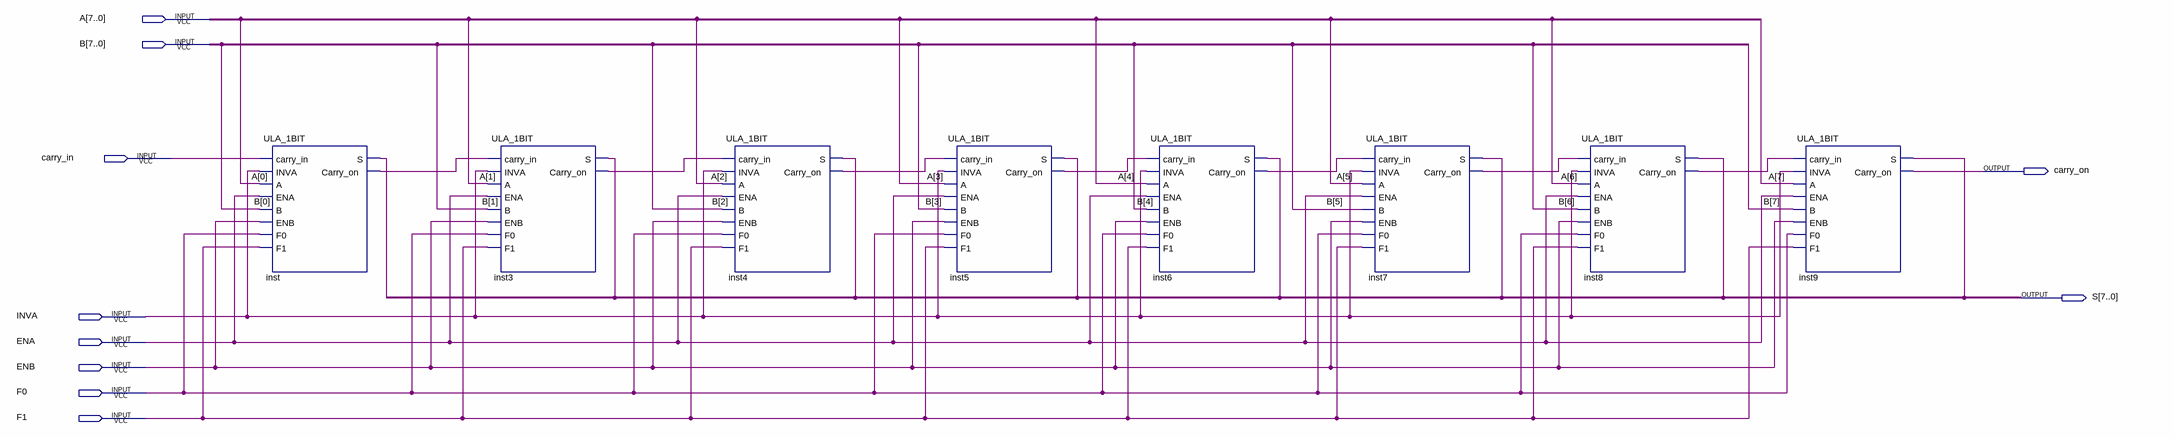
[diagram p0: schematic sheet]
// Quartus schematic ULA_8BIT.bdf as structural Verilog: 8 symbols, 10 pins
module ULA_8BIT (
  input  [7:0] A,
  input  [7:0] B,
  input  carry_in,
  input  INVA,
  input  ENA,
  input  ENB,
  input  F0,
  input  F1,
  output carry_on,
  output [7:0] S
);

  wire inst3_carry_on, inst3_s, inst4_carry_on, inst4_s, inst5_carry_on, inst5_s, inst6_carry_on, inst6_s,
       inst7_carry_on, inst7_s, inst8_carry_on, inst8_s, inst9_s, inst_carry_on, inst_s;

  ULA_1BIT inst (
    .carry_in(carry_in), .INVA(INVA), .A(A[0]), .ENA(ENA), .B(B[0]), .ENB(ENB), .F0(F0), .F1(F1), .S(inst_s),
    .Carry_on(inst_carry_on));
  ULA_1BIT inst3 (
    .carry_in(inst_carry_on), .INVA(INVA), .A(A[1]), .ENA(ENA), .B(B[1]), .ENB(ENB), .F0(F0), .F1(F1),
    .S(inst3_s), .Carry_on(inst3_carry_on));
  ULA_1BIT inst4 (
    .carry_in(inst3_carry_on), .INVA(INVA), .A(A[2]), .ENA(ENA), .B(B[2]), .ENB(ENB), .F0(F0), .F1(F1),
    .S(inst4_s), .Carry_on(inst4_carry_on));
  ULA_1BIT inst5 (
    .carry_in(inst4_carry_on), .INVA(INVA), .A(A[3]), .ENA(ENA), .B(B[3]), .ENB(ENB), .F0(F0), .F1(F1),
    .S(inst5_s), .Carry_on(inst5_carry_on));
  ULA_1BIT inst6 (
    .carry_in(inst5_carry_on), .INVA(INVA), .A(A[4]), .ENA(ENA), .B(B[4]), .ENB(ENB), .F0(F0), .F1(F1),
    .S(inst6_s), .Carry_on(inst6_carry_on));
  ULA_1BIT inst7 (
    .carry_in(inst6_carry_on), .INVA(INVA), .A(A[5]), .ENA(ENA), .B(B[5]), .ENB(ENB), .F0(F0), .F1(F1),
    .S(inst7_s), .Carry_on(inst7_carry_on));
  ULA_1BIT inst8 (
    .carry_in(inst7_carry_on), .INVA(INVA), .A(A[6]), .ENA(ENA), .B(B[6]), .ENB(ENB), .F0(F0), .F1(F1),
    .S(inst8_s), .Carry_on(inst8_carry_on));
  ULA_1BIT inst9 (
    .carry_in(inst8_carry_on), .INVA(INVA), .A(A[7]), .ENA(ENA), .B(B[7]), .ENB(ENB), .F0(F0), .F1(F1),
    .S(inst9_s), .Carry_on(carry_on));
endmodule
